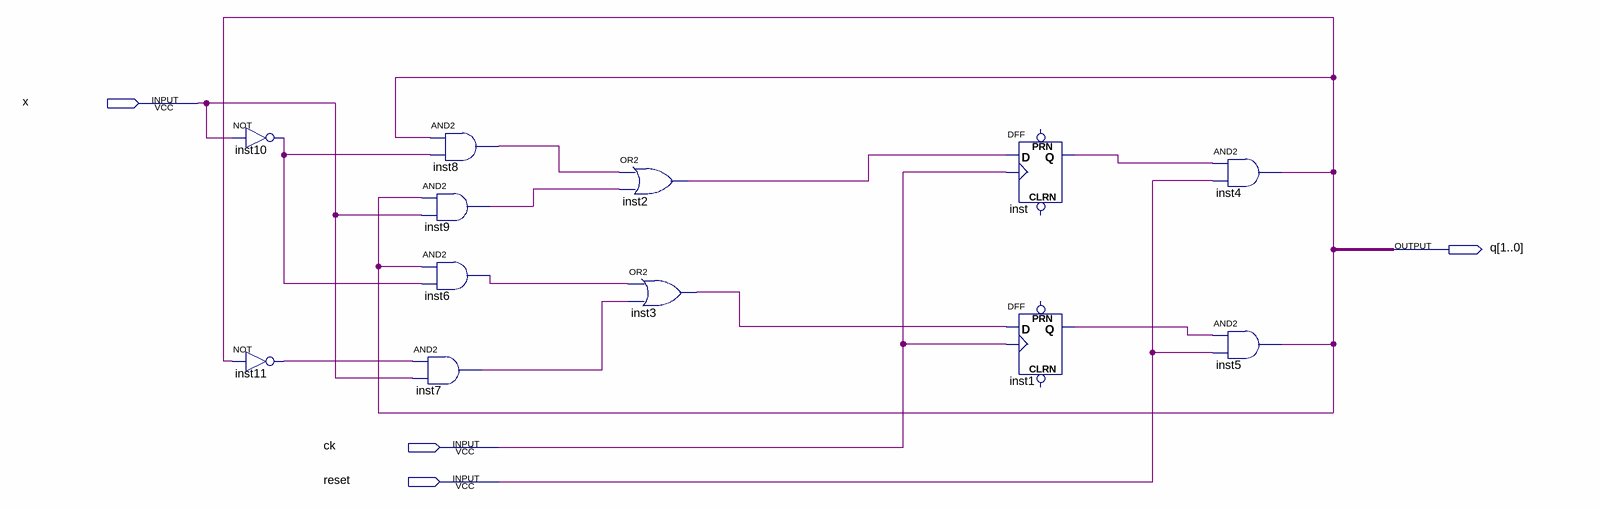
[diagram p0: schematic sheet]
// Quartus schematic MEF.bdf as structural Verilog: 12 symbols, 4 pins
module MEF (
  input  x,
  input  ck,
  input  reset,
  output [1:0] q
);

  wire inst1_q, inst2_out, inst3_out, inst4_out, inst6_out, inst7_out, inst8_out, inst9_out, inst10_out,
       inst11_out, inst_q;

  not inst10 (inst10_out, x);
  not inst11 (inst11_out, inst4_out);
  and inst8 (inst8_out, inst4_out, inst10_out);
  and inst9 (inst9_out, inst4_out, x);
  and inst6 (inst6_out, inst4_out, inst10_out);
  and inst7 (inst7_out, inst11_out, x);
  or inst2 (inst2_out, inst8_out, inst9_out);
  or inst3 (inst3_out, inst6_out, inst7_out);
  DFF inst (.CLK(ck), .D(inst2_out), .Q(inst_q));  // open: CLRN, PRN
  DFF inst1 (.CLK(ck), .D(inst3_out), .Q(inst1_q));  // open: CLRN, PRN
  and inst4 (inst4_out, inst_q, reset);
  and inst5 (inst4_out, inst1_q, reset);
endmodule
